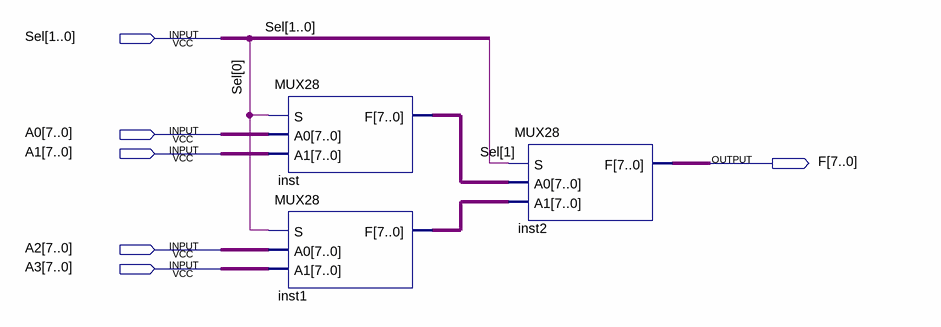
[diagram p0: schematic sheet]
// Quartus schematic MUX48.bdf as structural Verilog: 3 symbols, 6 pins
module MUX48 (
  input  [1:0] Sel,
  input  [7:0] A0,
  input  [7:0] A1,
  input  [7:0] A2,
  input  [7:0] A3,
  output [7:0] F
);

  wire [7:0] inst1_f, inst_f;

  MUX28 inst (.S(Sel[0]), .A0(A0), .A1(A1), .F(inst_f));
  MUX28 inst1 (.S(Sel[0]), .A0(A2), .A1(A3), .F(inst1_f));
  MUX28 inst2 (.S(Sel[1]), .A0(inst_f), .A1(inst1_f), .F(F));
endmodule
